# Altium project Fan_Module.PrjPcb
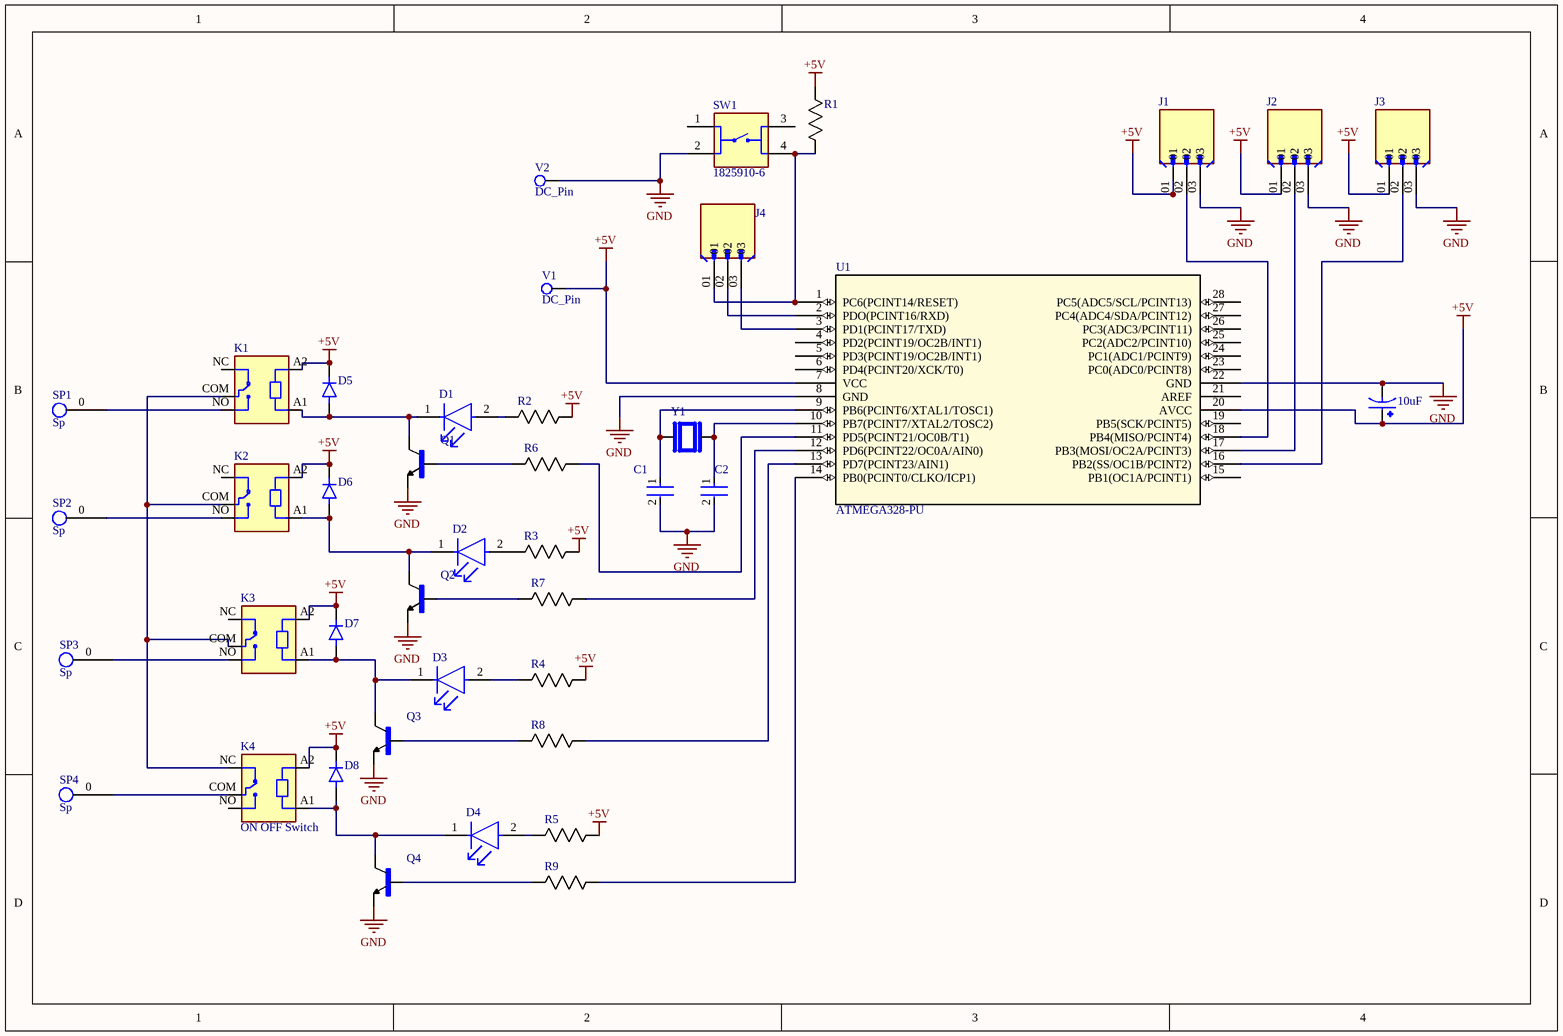
[diagram p0: Fan_Module.SchDoc]
1 sheet, 41 parts. Net scope: global (net labels, ports and power ports of the same name join across sheets).
Board file: Fan_Module.PcbDoc

## Sheet Fan_Module.SchDoc
size A4; SheetNumber: 1; SheetTotal: 1

### Parts
10uF  ECEA1HN100UI  [CAPPRD250W50D630H1120]  (value not drawn)
C1  RDE5C2A220J0M1H03A  [FP-RDE0M1-MFG]  (value not drawn)
C2  RDE5C2A220J0M1H03A  [FP-RDE0M1-MFG]  (value not drawn)
D1  TSFF5210  [FP-6_544-5258_09-4-MFG]  (value not drawn)
D2  TSFF5210  [FP-6_544-5258_09-4-MFG]  (value not drawn)
D3  TSFF5210  [FP-6_544-5258_09-4-MFG]  (value not drawn)
D4  TSFF5210  [FP-6_544-5258_09-4-MFG]  (value not drawn)
D5  1N4007G  [DIOAD1036W78L470D235]  (value not drawn)
D6  1N4007G  [DIOAD1036W78L470D235]  (value not drawn)
D7  1N4007G  [DIOAD1036W78L470D235]  (value not drawn)
D8  1N4007G  [DIOAD1036W78L470D235]  (value not drawn)
J1  68001-203HLF  [AMPHENOL_68001-203HLF]  (value not drawn)
J2  68001-203HLF  [AMPHENOL_68001-203HLF]  (value not drawn)
J3  68001-203HLF  [AMPHENOL_68001-203HLF]  (value not drawn)
J4  68001-203HLF  [AMPHENOL_68001-203HLF]  (value not drawn)
K1  SRD-05VDC-SL-C  [RELAY_SRD-05VDC-SL-C]  (value not drawn)
K2  SRD-05VDC-SL-C  [RELAY_SRD-05VDC-SL-C]  (value not drawn)
K3  SRD-05VDC-SL-C  [RELAY_SRD-05VDC-SL-C]  (value not drawn)
K4  ON OFF Switch  [RELAY_SRD-05VDC-SL-C]
Q1  2N3904  [TO92127P495H495-3]  (value not drawn)
Q2  2N3904  [TO92127P495H495-3]  (value not drawn)
Q3  2N3904  [TO92127P495H495-3]  (value not drawn)
Q4  2N3904  [TO92127P495H495-3]  (value not drawn)
R1  MFR-25FRF52-10K  [YAG_MF25_YAG]  (value not drawn)
R2  MFR-25FRF52-10K  [YAG_MF25_YAG]  (value not drawn)
R3  MFR-25FRF52-10K  [YAG_MF25_YAG]  (value not drawn)
R4  MFR-25FRF52-10K  [YAG_MF25_YAG]  (value not drawn)
R5  MFR-25FRF52-10K  [YAG_MF25_YAG]  (value not drawn)
R6  MFR-25FRF52-10K  [YAG_MF25_YAG]  (value not drawn)
R7  MFR-25FRF52-10K  [YAG_MF25_YAG]  (value not drawn)
R8  MFR-25FRF52-10K  [YAG_MF25_YAG]  (value not drawn)
R9  MFR-25FRF52-10K  [YAG_MF25_YAG]  (value not drawn)
SP1  Sp  [solderPoint]
SP2  Sp  [solderPoint]
SP3  Sp  [solderPoint]
SP4  Sp  [solderPoint]
SW1  1825910-6  [SW_1825910-6-4]
U1  ATMEGA328-PU  [28P3_SPDIP28_SP_MCH]
V1  DC_Pin  [DC_Pin]
V2  DC_Pin  [DC_Pin]
Y1  ABL-16.000MHZ-B2  [XTAL_HC49P488W46L1150T500H350]  (value not drawn)

### Nets
+5V: 10uF.P D5.C(K) D6.C(K) D7.C(K) D8.C(K) J1.01 J2.01 J3.01 K1.A2 K2.A2 K3.A2 K4.A2 R1.2 R2.2 R3.2 R4.2 R5.2 U1.7(VCC) U1.20(AVCC) V1.0
GND: 10uF.N C1.2 C2.2 J1.03 J2.03 J3.03 Q1.1(E) Q2.1(E) Q3.1(E) Q4.1(E) SW1.2 U1.8(GND) U1.22(GND) V2.0
NetC1_1: C1.1 U1.9(PB6(PCINT6/XTAL1/TOSC1)) Y1.1
NetC2_1: C2.1 U1.10(PB7(PCINT7/XTAL2/TOSC2)) Y1.2
NetD1_1: D1.1(C) D5.A K1.A1 Q1.3(C)
NetD1_2: D1.2(A) R2.1
NetD2_1: D2.1(C) D6.A K2.A1 Q2.3(C)
NetD2_2: D2.2(A) R3.1
NetD3_1: D3.1(C) D7.A K3.A1 Q3.3(C)
NetD3_2: D3.2(A) R4.1
NetD4_1: D4.1(C) D8.A K4.A1 Q4.3(C)
NetD4_2: D4.2(A) R5.1
NetJ1_02: J1.02 U1.18(PB4(MISO/PCINT4))
NetJ2_02: J2.02 U1.17(PB3(MOSI/OC2A/PCINT3))
NetJ3_02: J3.02 U1.16(PB2(SS/OC1B/PCINT2))
NetJ4_01: J4.01 R1.1 SW1.4 U1.1(PC6(PCINT14/RESET))
NetJ4_02: J4.02 U1.2(PDO(PCINT16/RXD))
NetJ4_03: J4.03 U1.3(PD1(PCINT17/TXD))
NetK1_COM: K1.COM K2.COM K3.COM K4.NC
NetK1_NO: K1.NO SP1.0
NetK2_NO: K2.NO SP2.0
NetK3_NO: K3.NO SP3.0
NetK4_COM: K4.COM SP4.0
NetQ1_2: Q1.2(B) R6.1
NetQ2_2: Q2.2(B) R7.1
NetQ3_2: Q3.2(B) R8.1
NetQ4_2: Q4.2(B) R9.1
NetR6_2: R6.2 U1.11(PD5(PCINT21/OC0B/T1))
NetR7_2: R7.2 U1.12(PD6(PCINT22/OC0A/AIN0))
NetR8_2: R8.2 U1.13(PD7(PCINT23/AIN1))
NetR9_2: R9.2 U1.14(PB0(PCINT0/CLKO/ICP1))

Not connected (* = marked no-connect by the designer): K1 NC; K2 NC; K3 NC; K4 NO; SW1 1 3; U1 4(PD2(PCINT19/OC2B/INT1)) 5(PD3(PCINT19/OC2B/INT1)) 6(PD4(PCINT20/XCK/T0)) 15(PB1(OC1A/PCINT1)) 19(PB5(SCK/PCINT5)) 21(AREF) 23(PC0(ADC0/PCINT8)) 24(PC1(ADC1/PCINT9)) 25(PC2(ADC2/PCINT10)) 26(PC3(ADC3/PCINT11)) 27(PC4(ADC4/SDA/PCINT12)) 28(PC5(ADC5/SCL/PCINT13))

### Library data of the parts
10uF = ECEA1HN100UI: CAP ALUM 10UF 20% 50V RADIAL; MP: ECE-A1HN100UI; MF: Panasonic; SnapEDA_Link: https://www.snapeda.com/parts/ECE-A1HN100UI/Panasonic/view-part/2321690/?ref=snap; Price: None; Check_prices: https://www.snapeda.com/parts/ECE-A1HN100UI/Panasonic/view-part/2321690/?ref=eda; Value: *; Availability: In Stock; Package: RADIAL-2 Panasonic
C1 C2 = CMP-06035-022985-1: Ceramic Capacitor 22pF ±5% 100V C0G Radial; Lead Diameter: 0.5mm; Mount: Through Hole; Min Operating Temperature: -55°C; Height: 3.5mm; Width: 0.098inch; Packaging: Cut Tape; Resistor Type: Ceramic; Case/Package: Radial; Capacitance: 22pF; Voltage Rating: 100V; Height - Seated (Max): 0.236inch; Max Operating Temperature: 125°C; Dielectric: C0G; Package Quantity: 1; Voltage Rating (DC): 100V; Lead Free: Lead Free; Lead Pitch: 0.197inch; Termination: Radial; Tolerance: 5%; Length: 0.157inch
D1-D4 = CMP-00030-41223146-1: TSFF5210 TSFF5210 IR LED, 870nm, T-1 3/4 (5mm) Through Hole package | Siliconix / Vishay TSFF5210; Number of Elements: 1; Power Dissipation: 180W; Viewing Angle: 20°; Power Rating: 250mW; Test Current: 100mA; Forward Voltage: 1.5V; Lens Style: Circular, Colorless, Diffused, Round; Rise Time: 15ns; Reverse Voltage: 5V; REACH SVHC: Unknown; Packaging: Bulk; Schedule B: 8541402000, 8541402000|8541402000|8541402000|8541402000|8541402000; Number of LEDs: 1; Mount: Through Hole; Depth: 5.8mm; Max Operating Temperature: 85°C; Radiation Hardening: No; Case/Package: Radial; NexarPartId: 41223146; Lead Free: Lead Free; Number of Pins: 2; Wavelength: 870nm; RoHS: Compliant; Orientation: Top View; Length: 5.8mm; Peak Wavelength: 870nm; Contact Plating: Tin; Min Operating Temperature: -40°C; Forward Current: 100mA
D5-D8 = 1N4007G: 1A, 1000V, Standard Recovery Rectifier; MF: Taiwan Semiconductor; Check_prices: https://www.snapeda.com/parts/1N4007G/Taiwan+Semiconductor/view-part/?ref=eda; Value: *; Availability: In Stock; MP: 1N4007G; Price: None; Package: DO-41 Taiwan Semiconductor; SnapEDA_Link: https://www.snapeda.com/parts/1N4007G/Taiwan+Semiconductor/view-part/?ref=snap; Purchase-URL: https://pricing.snapeda.com/search/part/1N4007G/?ref=eda
J1-J4 = 68001-203HLF: BergStik<sup>&reg;</sup>, Board to Board connector, Unshrouded vertical header, Through Hole, Single Row, , 3 Positions, 2.54 mm (0.100in) Pitch.; MF: Amphenol ICC; Package: None; Price: None; Check_prices: https://www.snapeda.com/parts/68001-203HLF/Amphenol+FCI/view-part/?ref=eda; Value: *; SnapEDA_Link: https://www.snapeda.com/parts/68001-203HLF/Amphenol+FCI/view-part/?ref=snap; MP: 68001-203HLF; Availability: In Stock; Purchase-URL: https://pricing.snapeda.com/search?q=68001-203HLF&ref=eda
K1-K4 = SRD-05VDC-SL-C: 5V Trigger Relay Module For Arduino And Raspberry Pi 5V Trigger Relay Module For Arduino And Raspberry Pi; MF: Songle Relay; Check_prices: https://www.snapeda.com/parts/SRD-05VDC-SL-C/Songle+Relay/view-part/?ref=eda; Value: *; Availability: Not in stock; Price: None; Package: NON STANDARD-5 Songle Relay; MP: SRD-05VDC-SL-C; SnapEDA_Link: https://www.snapeda.com/parts/SRD-05VDC-SL-C/Songle+Relay/view-part/?ref=snap
Q1-Q4 = 2N3904: TRANS NPN 40V 200MA TO92-3; MF: Rectron; SnapEDA_Link: https://www.snapeda.com/parts/2N3904/Rectron/view-part/?ref=snap; Package: TO-226-3 Rectron; MP: 2N3904; Check_prices: https://www.snapeda.com/parts/2N3904/Rectron/view-part/?ref=eda; Purchase-URL: https://pricing.snapeda.com/search/part/2N3904/?ref=eda; Price: None; Value: *; Availability: In Stock
R1-R9 = MFR-25FRF52-10K: No Description Available; Mfr_Name: Yageo
SP1-SP4 = soldPoint
SW1 = 1825910-6: Switch Push Button OFF (ON) SPST Round Button 0.05A 24VDC Momentary Contact PC Pins Thru-Hole; MF: TE Connectivity; Value: *; MP: 1825910-6; Package: None; Check_prices: https://www.snapeda.com/parts/1825910-6/TE+Connectivity+ALCOSWITCH+Switches/view-part/?ref=eda; SnapEDA_Link: https://www.snapeda.com/parts/1825910-6/TE+Connectivity+ALCOSWITCH+Switches/view-part/?ref=snap; Digi-Key_Part_Number: 450-1650-ND; Purchase-URL: https://pricing.snapeda.com/search/part/1825910-6/?ref=eda
U1 = ATMEGA328-PU: No Description Available; Mfr_Name: Microchip; RefDes: RefDes; Type: Type
Y1 = ABL-16.000MHZ-B2: HC/49US (AT49) MICROPROCESSOR CRYSTAL; MF: Abracon; Availability: In Stock; SnapEDA_Link: https://www.snapeda.com/parts/ABL-16.000MHZ-B2/Abracon+LLC/view-part/?ref=snap; MP: ABL-16.000MHZ-B2; Price: None; Value: *; Check_prices: https://www.snapeda.com/parts/ABL-16.000MHZ-B2/Abracon+LLC/view-part/?ref=eda; Purchase-URL: https://pricing.snapeda.com/search/part/ABL-16.000MHZ-B2/?ref=eda; Package: HC-49/US ABRACON